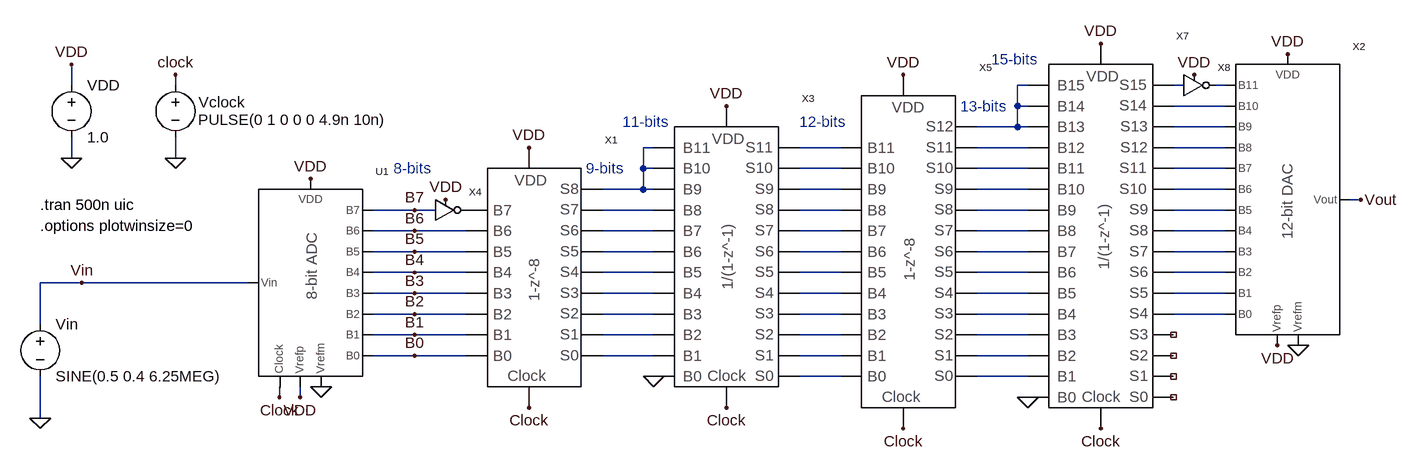
[diagram p0: schematic _Fig4_15_L=2_MSD.asc]
_Fig4_15_L=2_MSD.asc, the LTspice schematic file:
Version 4
SHEET 1 2740 696
WIRE 496 -688 496 -720
WIRE 656 -688 656 -704
WIRE 1968 -688 1952 -688
WIRE 2208 -688 2192 -688
WIRE 2272 -688 2256 -688
WIRE 1952 -656 1952 -688
WIRE 1968 -656 1952 -656
WIRE 2272 -656 2192 -656
WIRE 1952 -624 1952 -656
WIRE 1952 -624 1888 -624
WIRE 1968 -624 1952 -624
WIRE 2272 -624 2192 -624
WIRE 1392 -592 1376 -592
WIRE 1680 -592 1616 -592
WIRE 1968 -592 1888 -592
WIRE 2272 -592 2192 -592
WIRE 496 -576 496 -608
WIRE 656 -576 656 -608
WIRE 1376 -560 1376 -592
WIRE 1392 -560 1376 -560
WIRE 1680 -560 1616 -560
WIRE 1968 -560 1888 -560
WIRE 2272 -560 2192 -560
WIRE 1376 -528 1376 -560
WIRE 1376 -528 1312 -528
WIRE 1392 -528 1376 -528
WIRE 1680 -528 1616 -528
WIRE 1968 -528 1888 -528
WIRE 2272 -528 2192 -528
WIRE 2480 -512 2464 -512
WIRE 1024 -496 960 -496
WIRE 1056 -496 1024 -496
WIRE 1392 -496 1312 -496
WIRE 1680 -496 1616 -496
WIRE 1968 -496 1888 -496
WIRE 2272 -496 2192 -496
WIRE 1024 -464 960 -464
WIRE 1104 -464 1024 -464
WIRE 1392 -464 1312 -464
WIRE 1680 -464 1616 -464
WIRE 1968 -464 1888 -464
WIRE 2272 -464 2192 -464
WIRE 1024 -432 960 -432
WIRE 1104 -432 1024 -432
WIRE 1392 -432 1312 -432
WIRE 1680 -432 1616 -432
WIRE 1968 -432 1888 -432
WIRE 2272 -432 2192 -432
WIRE 1024 -400 960 -400
WIRE 1104 -400 1024 -400
WIRE 1392 -400 1312 -400
WIRE 1680 -400 1616 -400
WIRE 1968 -400 1888 -400
WIRE 2272 -400 2192 -400
WIRE 512 -384 448 -384
WIRE 768 -384 512 -384
WIRE 1024 -368 960 -368
WIRE 1104 -368 1024 -368
WIRE 1392 -368 1312 -368
WIRE 1680 -368 1616 -368
WIRE 1968 -368 1888 -368
WIRE 2272 -368 2192 -368
WIRE 1024 -336 960 -336
WIRE 1104 -336 1024 -336
WIRE 1392 -336 1312 -336
WIRE 1680 -336 1616 -336
WIRE 1968 -336 1888 -336
WIRE 2272 -336 2192 -336
WIRE 448 -320 448 -384
WIRE 1024 -304 960 -304
WIRE 1104 -304 1024 -304
WIRE 1392 -304 1312 -304
WIRE 1680 -304 1616 -304
WIRE 1968 -304 1888 -304
WIRE 1024 -272 960 -272
WIRE 1104 -272 1024 -272
WIRE 1392 -272 1312 -272
WIRE 1680 -272 1616 -272
WIRE 1968 -272 1888 -272
WIRE 1680 -240 1616 -240
WIRE 1968 -240 1888 -240
WIRE 816 -208 816 -224
WIRE 848 -208 848 -224
WIRE 448 -176 448 -240
FLAG 448 -176 0
FLAG 512 -384 Vin
FLAG 656 -576 0
FLAG 656 -704 clock
FLAG 496 -576 0
FLAG 496 -720 VDD
FLAG 2480 -512 Vout
FLAG 2368 -736 VDD
FLAG 2384 -288 0
FLAG 1024 -496 B7
FLAG 1024 -464 B6
FLAG 1024 -432 B5
FLAG 1024 -400 B4
FLAG 1024 -368 B3
FLAG 1024 -336 B2
FLAG 1024 -304 B1
FLAG 1024 -272 B0
FLAG 1200 -592 VDD
FLAG 864 -544 VDD
FLAG 880 -224 0
FLAG 816 -208 Clock
FLAG 848 -208 VDD
FLAG 1200 -192 Clock
FLAG 2352 -288 VDD
FLAG 1504 -656 VDD
FLAG 1504 -192 Clock
FLAG 1072 -512 VDD
FLAG 1776 -704 VDD
FLAG 1776 -160 Clock
FLAG 2080 -752 VDD
FLAG 2080 -160 Clock
FLAG 1968 -208 0
FLAG 1392 -240 0
FLAG 2224 -704 VDD
SYMBOL voltage 448 -336 R0
WINDOW 123 0 0 Left 0
WINDOW 39 0 0 Left 0
SYMATTR InstName Vin
SYMATTR Value SINE(0.5 0.4 6.25MEG)
SYMBOL voltage 656 -704 R0
WINDOW 0 36 42 Left 0
WINDOW 3 35 69 Left 0
WINDOW 123 0 0 Left 0
WINDOW 39 0 0 Left 0
SYMATTR InstName Vclock
SYMATTR Value PULSE(0 1 0 0 0 4.9n 10n)
SYMBOL voltage 496 -704 R0
WINDOW 123 0 0 Left 0
WINDOW 39 0 0 Left 0
SYMATTR InstName VDD
SYMATTR Value 1.0
SYMBOL Ideal_8_bit_ADC 784 -240 R0
SYMATTR InstName U1
SYMBOL Ideal_12_bit_DAC 2288 -304 R0
SYMATTR InstName X2
SYMBOL 8_bit_comb_K_8 1136 -224 R0
SYMATTR InstName X1
SYMBOL 12_bit_integrator 1424 -224 R0
SYMATTR InstName X3
SYMBOL inverter 1056 -496 R0
SYMATTR InstName X4
SYMBOL 12_bit_comb_K_8 1712 -192 R0
SYMATTR InstName X5
SYMBOL 16_bit_integrator 2000 -192 R0
SYMATTR InstName X7
SYMBOL inverter 2208 -688 R0
SYMATTR InstName X8
TEXT 448 -504 Left 0 !.tran 500n uic
TEXT 448 -472 Left 0 !.options plotwinsize=0
TEXT 992 -560 Left 0 ;8-bits
TEXT 1288 -560 Left 0 ;9-bits
TEXT 1344 -632 Left 0 ;11-bits
TEXT 1616 -632 Left 0 ;12-bits
TEXT 1864 -656 Left 0 ;13-bits
TEXT 1912 -728 Left 0 ;15-bits

The netlist it stands for:
* _Fig4_15_L=2_MSD.asc
Vin Vin 0 SINE(0.5 0.4 6.25MEG)
Vclock clock 0 PULSE(0 1 0 0 0 4.9n 10n)
VDD VDD 0 1.0
XU1 B7 B6 B5 B4 B3 B2 B1 B0 Vin VDD 0 clock VDD Ideal_8_bit_ADC  ; pins B7 B6 B5 B4 B3 B2 B1 B0 Vin Vrefp Vrefm Clock VDD
XX2 N003 N004 N005 N009 N012 N015 N019 N023 N027 N031 N035 N039 Vout VDD 0 VDD Ideal_12_bit_DAC  ; pins B11 B10 B9 B8 B7 B6 B5 B4 B3 B2 B1 B0 Vout Vrefp Vrefm VDD
XX1 B0 B1 B2 B3 B4 B5 B6 P001 N043 N040 N036 N032 N028 N024 N020 N016 N006 clock VDD 8_bit_comb_K_8  ; pins B0 B1 B2 B3 B4 B5 B6 B7 S0 S1 S2 S3 S4 S5 S6 S7 S8 Clock VDD
XX3 0 N043 N040 N036 N032 N028 N024 N020 N016 N006 N006 N006 N046 N044 N041 N037 N033 N029 N025 N021 N017 N013 N010 N007 clock VDD 12_bit_integrator  ; pins B0 B1 B2 B3 B4 B5 B6 B7 B8 B9 B10 B11 S0 S1 S2 S3 S4 S5 S6 S7 S8 S9 S10 S11 Clock VDD
XX4 B7 P001 VDD inverter  ; pins In Out VDD
XX5 N046 N044 N041 N037 N033 N029 N025 N021 N017 N013 N010 N007 N047 N045 N042 N038 N034 N030 N026 N022 N018 N014 N011 N008 N001 clock VDD 12_bit_comb_K_8  ; pins B0 B1 B2 B3 B4 B5 B6 B7 B8 B9 B10 B11 S0 S1 S2 S3 S4 S5 S6 S7 S8 S9 S10 S11 S12 Clock VDD
XX7 0 N047 N045 N042 N038 N034 N030 N026 N022 N018 N014 N011 N008 N001 N001 N001 NC_01 NC_02 NC_03 NC_04 N039 N035 N031 N027 N023 N019 N015 N012 N009 N005 N004 N002 clock VDD 16_bit_integrator  ; pins B0 B1 B2 B3 B4 B5 B6 B7 B8 B9 B10 B11 B12 B13 B14 B15 S0 S1 S2 S3 S4 S5 S6 S7 S8 S9 S10 S11 S12 S13 S14 S15 Clock VDD
XX8 N002 N003 VDD inverter  ; pins In Out VDD
.tran 500n uic
.options plotwinsize=0
* 8-bits
* 9-bits
* 11-bits
* 12-bits
* 13-bits
* 15-bits
.backanno
.end